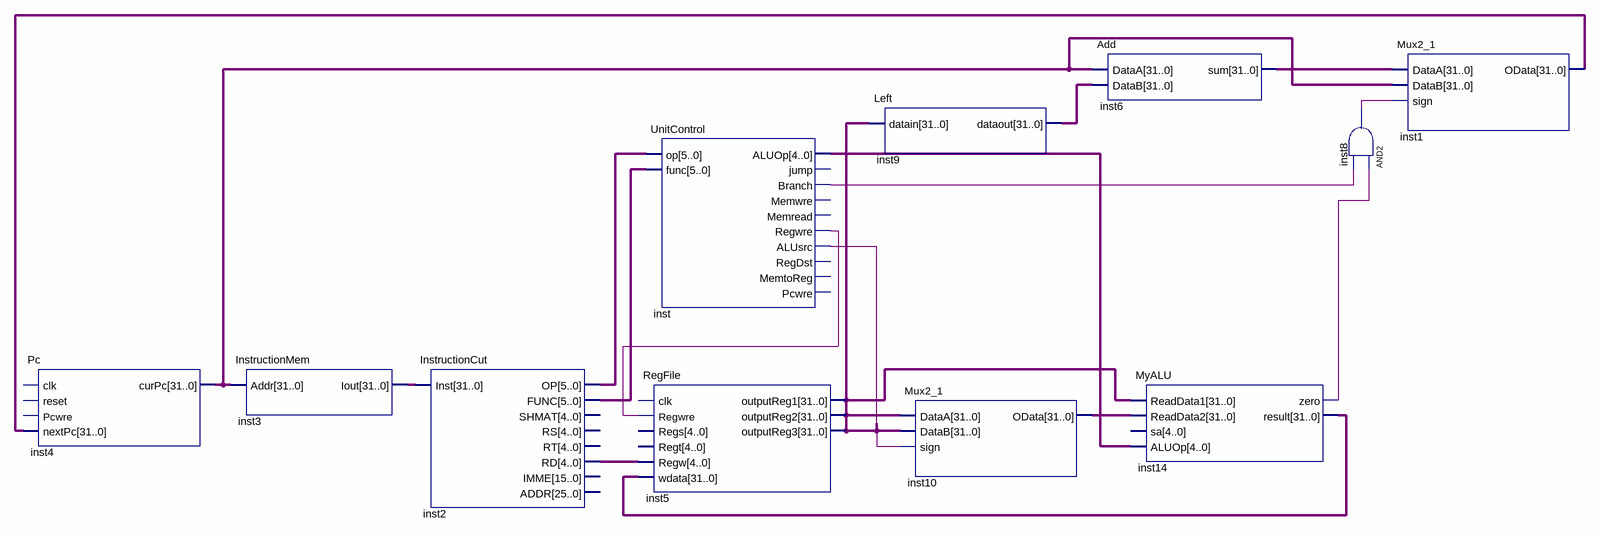
[diagram p0: schematic sheet]
// Quartus schematic Cpu_add.bdf as structural Verilog: 11 symbols, 0 pins
module Cpu_add (
);

  wire inst8_out, inst14_zero, inst_alusrc, inst_branch, inst_regwre, undriven;
  wire [4:0] inst2_rd, inst_aluop;
  wire [5:0] inst2_func, inst2_op;
  wire [31:0] inst1_odata, inst3_iout, inst4_curpc, inst5_outputreg1, inst6_sum, inst9_dataout, inst10_odata,
       inst14_result;

  Pc inst4 (.nextPc(inst1_odata), .curPc(inst4_curpc));  // open: clk, reset, Pcwre
  InstructionMem inst3 (.Addr(inst4_curpc), .Iout(inst3_iout));
  InstructionCut inst2 (
    .Inst(inst3_iout), .OP(inst2_op), .FUNC(inst2_func), .RD(inst2_rd));  // open: SHMAT, RS, RT, IMME, ADDR
  UnitControl inst (
    .op(inst2_op), .func(inst2_func), .ALUOp(inst_aluop), .Branch(inst_branch), .Regwre(inst_regwre),
    .ALUsrc(inst_alusrc));  // open: jump, Memwre, Memread, RegDst, MemtoReg, Pcwre
  RegFile inst5 (
    .Regwre(inst_regwre), .Regw(inst2_rd), .wdata(inst14_result), .outputReg1(inst5_outputreg1),
    .outputReg2(inst5_outputreg1), .outputReg3(inst5_outputreg1));  // open: clk, Regs, Regt
  Left inst9 (.datain(inst5_outputreg1), .dataout(inst9_dataout));
  Mux2_1 inst10 (.DataA(inst5_outputreg1), .DataB(inst5_outputreg1), .sign(undriven), .OData(inst10_odata));
  Add inst6 (.DataA(inst4_curpc), .DataB(inst9_dataout), .sum(inst6_sum));
  MyALU inst14 (
    .ReadData1(inst5_outputreg1), .ReadData2(inst10_odata), .ALUOp(inst_aluop), .zero(inst14_zero),
    .result(inst14_result));  // open: sa
  Mux2_1 inst1 (.DataA(inst6_sum), .DataB(inst4_curpc), .sign(inst8_out), .OData(inst1_odata));
  and inst8 (inst8_out, inst14_zero, inst_branch);
endmodule
